# Altium project sha2017_rev1_0_0.PrjPcb
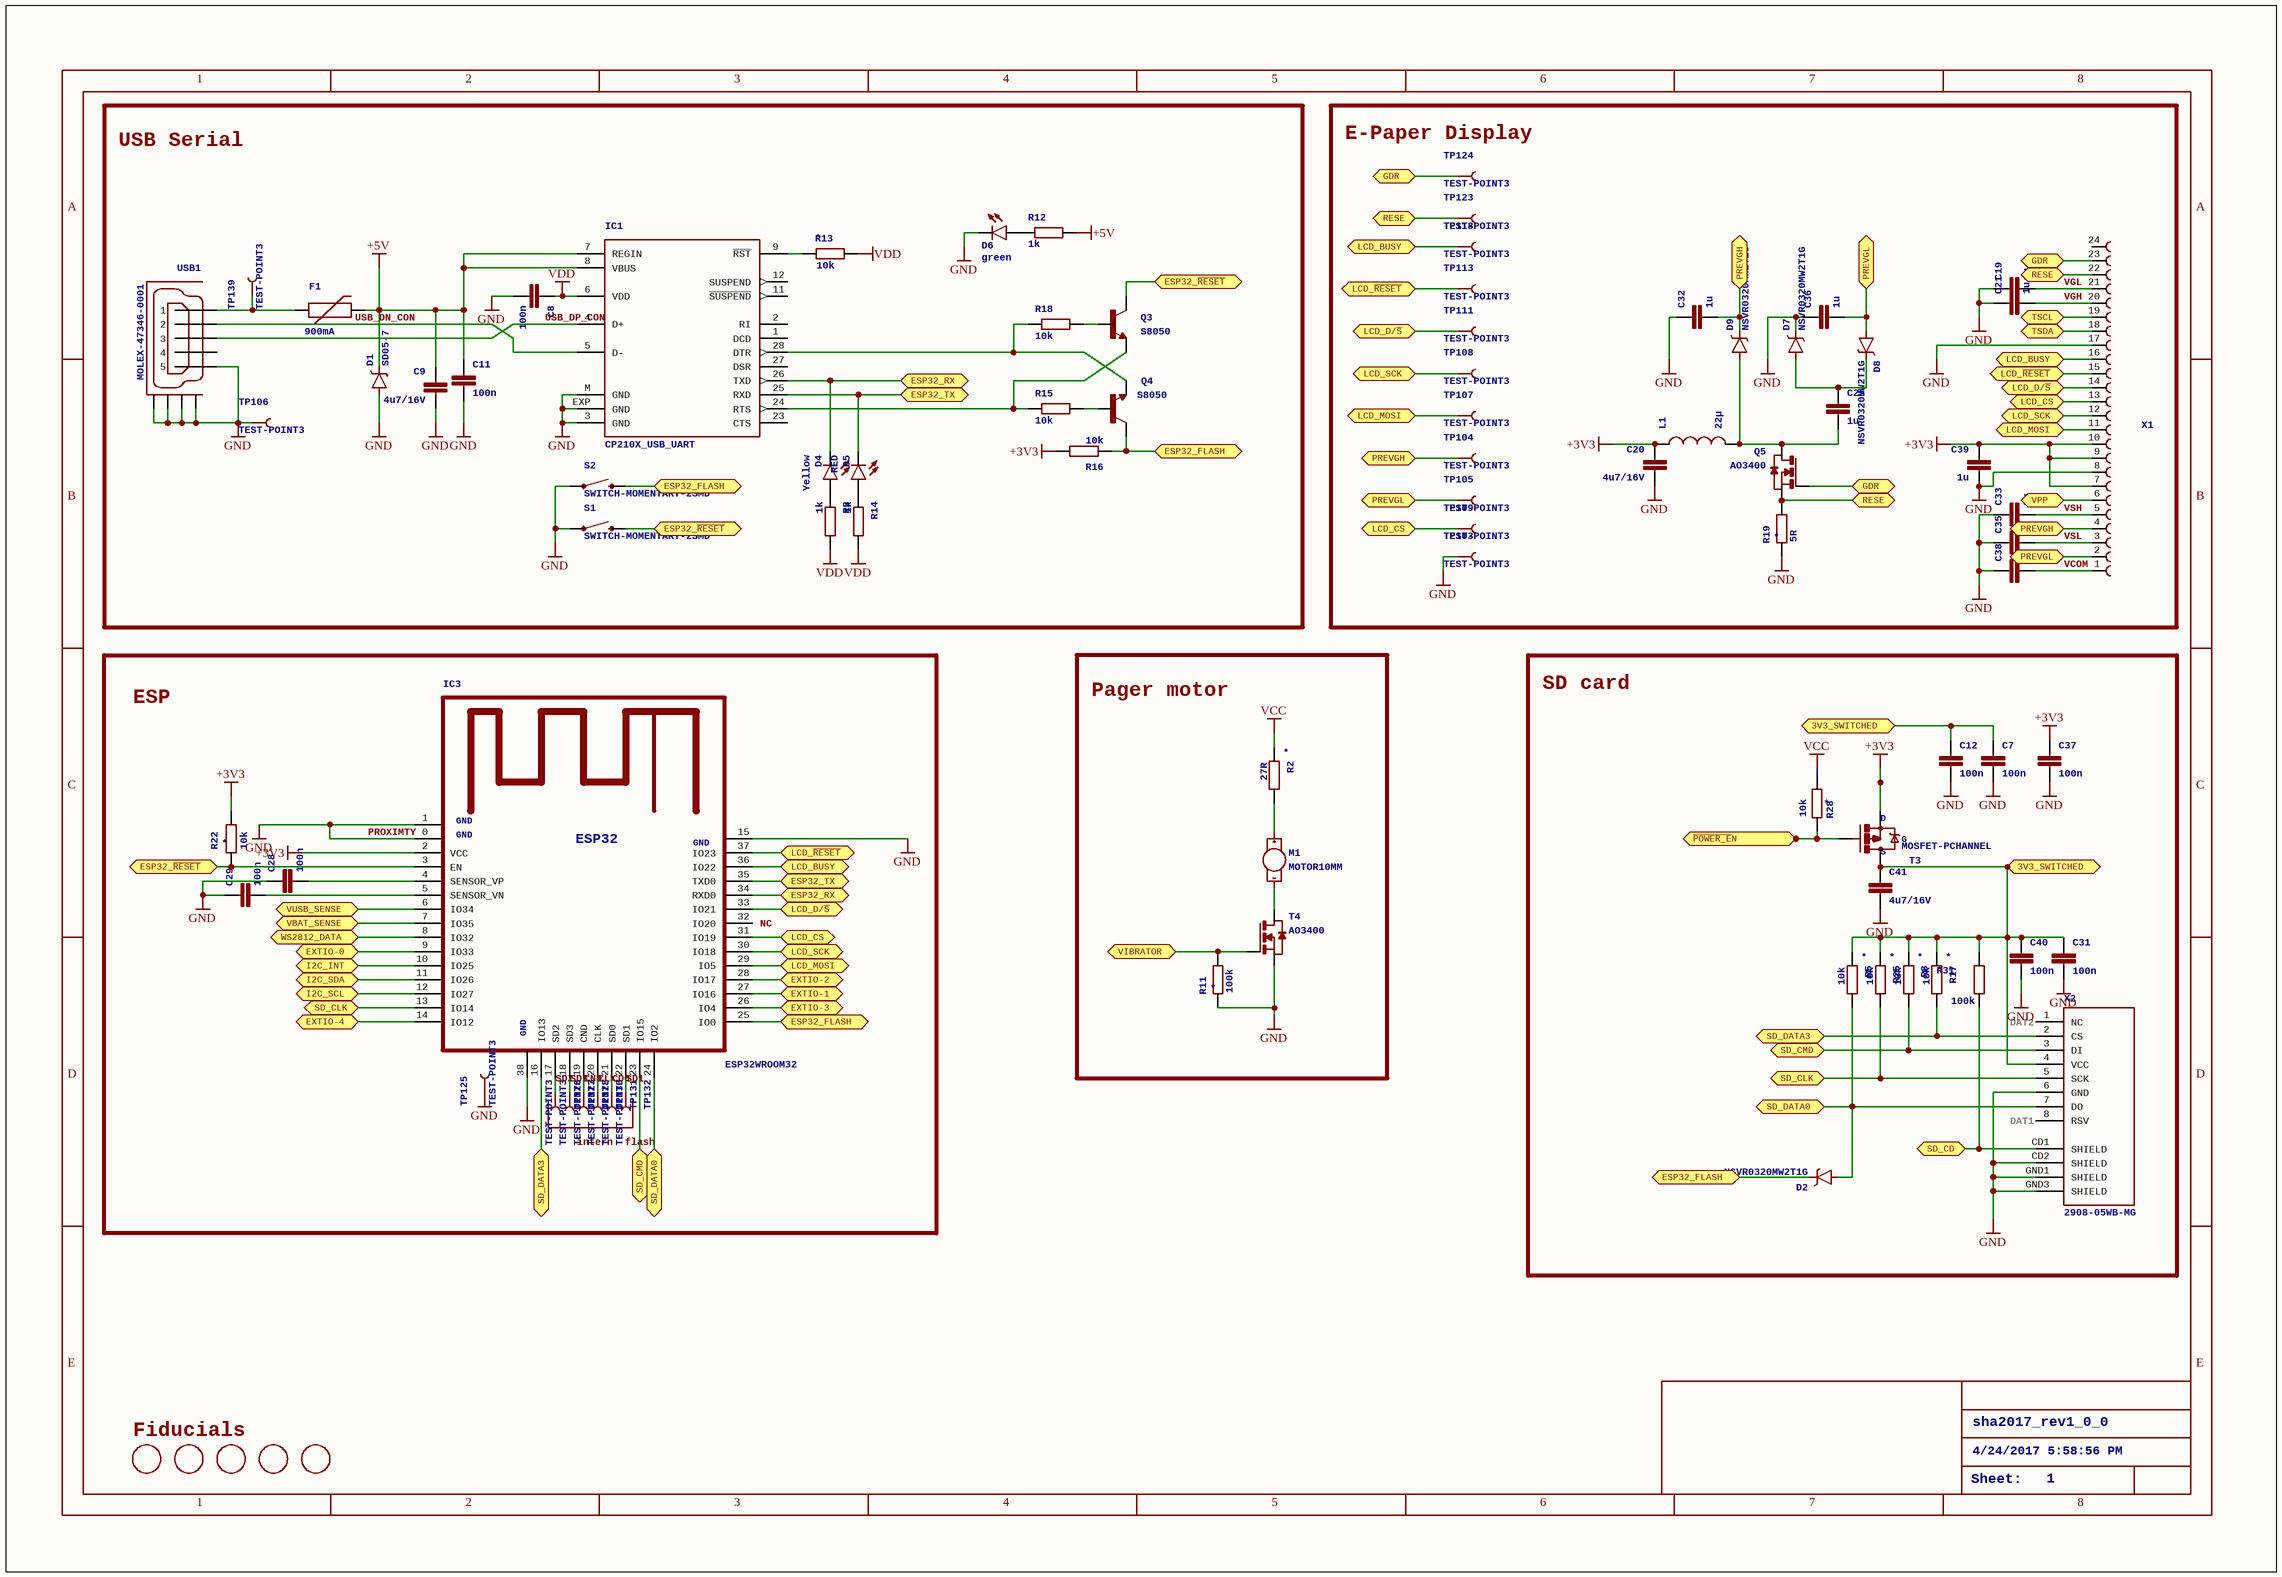
[diagram p0: sha2017_rev1_0_0_0.SchDoc]
3 sheets, 191 parts. Net scope: flat (ports and power ports of the same name join across sheets).
Board file: sha2017_rev1_0_0.PcbDoc
Sheets:
  sha2017_rev1_0_0_0.SchDoc
  sha2017_rev1_0_0_1.SchDoc
  sha2017_rev1_0_0_2.SchDoc

## Sheet sha2017_rev1_0_0_0.SchDoc: sha2017_rev1_0_0
size 409 x 282 mm; Date: 4/24/2017 5:58:56 PM; SheetNumber: 1

### Parts
C7  100n  [C0603-DASHES]
C8  100n  [C0603-DASHES]
C9  4u7/16V  [C0805]
C11  100n  [C0603-DASHES]
C12  100n  [C0603-DASHES]
C19  1u  [C0603-DASHES]
C20  4u7/16V  [C0805]
C21  1u  [C0603-DASHES]
C25  1u  [C0603-DASHES]
C28  100n  [C0603-DASHES]
C29  100n  [C0603-DASHES]
C31  100n  [C0603-DASHES]
C32  1u  [C0603-DASHES]
C33  1u  [C0603-DASHES]
C35  1u  [C0603-DASHES]
C36  1u  [C0603-DASHES]
C37  100n  [C0603-DASHES]
C38  1u  [C0603-DASHES]
C39  1u  [C0603-DASHES]
C40  100n  [C0603-DASHES]
C41  4u7/16V  [C0805]
D1  SD05-7  [SOD-323]
D2  NSVR0320MW2T1G  [SOD-323]
D4  Yellow  [LED-0603]
D5  RED  [LED-0603]
D6  green  [LED-0603]
D7  NSVR0320MW2T1G  [SOD-323]
D8  NSVR0320MW2T1G  [SOD-323]
D9  NSVR0320MW2T1G  [SOD-323]
F1  900mA  [PTC-1206]
FD1  FIDUCIAL  [FIDUCIAL_1MM]  (value not drawn)
FD2  FIDUCIAL  [FIDUCIAL_1MM]  (value not drawn)
FD3  FIDUCIAL  [FIDUCIAL_1MM]  (value not drawn)
FD4  FIDUCIAL  [FIDUCIAL_1MM]  (value not drawn)
FD5  FIDUCIAL  [FIDUCIAL_1MM]  (value not drawn)
IC1  CP210X_USB_UART  [MLP28]
IC3  ESP32WROOM32  [ESP32MOD]
L1  22µ  [1210]
M1  MOTOR10MM  [VIBE-MOTOR-10MM]
Q3  S8050  [SOT23-3]
Q4  S8050  [SOT23-3]
Q5  AO3400  [SOT-23]
R2  27R  [R0603-DASHES]
R3  1k  [R0603-DASHES]
R5  10k  [R0603-DASHES]
R8  10k  [R0603-DASHES]
R11  100k  [R0603-DASHES]
R12  1k  [R0603-DASHES]
R13  10k  [R0603-DASHES]
R14  1k  [R0603-DASHES]
R15  10k  [R0603-DASHES]
R16  10k  [R0603-DASHES]
R17  10k  [R0603-DASHES]
R18  10k  [R0603-DASHES]
R19  5R  [R0603-DASHES]
R22  10k  [R0603-DASHES]
R25  10k  [R0603-DASHES]
R28  10k  [R0603-DASHES]
R31  100k  [R0603-DASHES]
S1  SWITCH-MOMENTARY-2SMD  [TACTILE-SWITCH-SMD]
S2  SWITCH-MOMENTARY-2SMD  [TACTILE-SWITCH-SMD]
T3  MOSFET-PCHANNEL  [SOT23-3]
T4  AO3400  [SOT-23]
TP103  TEST-POINT3  [PAD.03X.03]
TP104  TEST-POINT3  [PAD.03X.03]
TP105  TEST-POINT3  [PAD.03X.03]
TP106  TEST-POINT3  [PAD.03X.03]
TP107  TEST-POINT3  [PAD.03X.03]
TP108  TEST-POINT3  [PAD.03X.03]
TP109  TEST-POINT3  [PAD.03X.03]
TP111  TEST-POINT3  [PAD.03X.03]
TP113  TEST-POINT3  [PAD.03X.03]
TP118  TEST-POINT3  [PAD.03X.03]
TP123  TEST-POINT3  [PAD.03X.03]
TP124  TEST-POINT3  [PAD.03X.03]
TP125  TEST-POINT3  [PAD.03X.03]
TP126  TEST-POINT3  [PAD.03X.03]
TP127  TEST-POINT3  [PAD.03X.03]
TP128  TEST-POINT3  [PAD.03X.03]
TP130  TEST-POINT3  [PAD.03X.03]
TP131  TEST-POINT3  [PAD.03X.03]
TP132  TEST-POINT3  [PAD.03X.03]
TP139  TEST-POINT3  [PAD.03X.03]
USB1  MOLEX-47346-0001  [MOLEX-47364-0001]
X1  68712414022  [68712414022]  (value not drawn)
X2  2908-05WB-MG  [MICRO-SD-SOCKET-PP]

### Blocks framed on the sheet
USB Serial: C8 C9 C11 D1 D4-D6 F1 IC1 Q3 Q4 R3 R12-R16 R18 S1 S2 TP106 TP139 USB1
E-Paper Display: C19-C21 C25 C32 C33 C35 C36 C38 C39 D7-D9 L1 Q5 R19 TP103-TP105 TP107-TP109 TP111 TP113 TP118 TP123 TP124 X1
ESP: C28 C29 IC3 R22 TP125-TP128 TP130-TP132
Pager motor: M1 R2 R11 T4
SD card: C7 C12 C31 C37 C40 C41 D2 R5 R8 R17 R25 R28 R31 T3 X2

### Ports
3V3_SWITCHED, ESP32_FLASH, ESP32_RX, ESP32_TX, ESP32_~{RESET}, EXTIO-0, EXTIO-1, EXTIO-2, EXTIO-3, EXTIO-4, GDR, I2C_INT, I2C_SCL, I2C_SDA, LCD_BUSY, LCD_CS, LCD_D/~{S}, LCD_MOSI, LCD_SCK, LCD_~{RESET}, PREVGH, PREVGL, RESE, SD_CD, SD_CLK, SD_CMD, SD_DATA0, SD_DATA3, TSCL, TSDA, VBAT_SENSE, VIBRATOR, VPP, VUSB_SENSE, WS2812_DATA, ~{POWER_E}N

### Nets
+3V3: C20.1 C37.1 C39.1 IC3.2(VCC) L1.1 R16.2 R22.1 T3.2(S) X1.7 X1.9 X1.10
+5V: C9.1 C11.1 D1.C F1.2 IC1.7(REGIN) IC1.8(VBUS) R12.2
PROXIMTY: C7.2 C8.2 C9.2 C11.2 C12.2 C19.1 C20.2 C21.1 C28.1 C29.1 C31.2 C32.1 C33.1 C35.1 C36.1 C37.2 C38.1 C39.2 C40.2 C41.2 D1.A D6.C D7.C IC1.3(GND) IC1.EXP(GND) IC1.M(GND) IC3.0(GND) IC3.1(GND) IC3.15(GND) IC3.38(GND) R11.2 R19.2 S1.1 S2.1 T4.2(S) TP103.P$1 TP106.P$1 TP125.P$1 USB1.5 USB1.GND1 USB1.GND2 USB1.GND3 USB1.GND4 X1.8 X1.17 X2.6(GND) X2.CD2(SHIELD) X2.GND1(SHIELD) X2.GND3(SHIELD)  [also labelled GND]
VCC: R2.2 R28.2
VDD: C8.1 IC1.6(VDD) R3.2 R13.1 R14.2
CD0: IC3.21(SD0) TP131.P$1
CLK: IC3.20(CLK) TP130.P$1
CND: IC3.19(CND) TP128.P$1
SD1: IC3.22(SD1) TP132.P$1
SD2: IC3.17(SD2) TP126.P$1
SD3: IC3.18(SD3) TP127.P$1
USB_DN_CON: IC1.5(D-) USB1.2
USB_DP_CON: IC1.4(D+) USB1.3
VCOM: C38.2 X1.1
VGH: C21.2 X1.20
VGL: C19.2 X1.21
VSH: C33.2 X1.5
VSL: C35.2 X1.3
NetC7_1: C7.1 C12.1 C31.1 C40.1 C41.1 R5.2 R8.2 R17.2 R25.2 R31.1 T3.3(D) X2.4(VCC) ; port 3V3_SWITCHED
NetC10_1: IC3.6(IO34) ; port VUSB_SENSE
NetC16_1: IC3.7(IO35) ; port VBAT_SENSE
NetC25_1: C25.1 D7.A D8.C
NetC25_2: C25.2 D9.A L1.2 Q5.1(D)
NetC28_2: C28.2 IC3.4(SENSOR_VP)
NetC29_2: C29.2 IC3.5(SENSOR_VN)
NetC32_2: C32.2 D9.C TP104.P$1 X1.4 ; port PREVGH
NetC36_2: C36.2 D8.A TP105.P$1 X1.2 ; port PREVGL
NetD2_A: D2.A IC3.24(IO2) R5.1 X2.7(DO) ; port SD_DATA0
NetD2_C: D2.C IC3.25(IO0) Q4.3(C) R16.1 S2.3 ; port ESP32_FLASH
NetD4_A: D4.A R3.1
NetD4_C: D4.C IC1.26(TXD) IC3.34(RXD0) ; port ESP32_RX
NetD5_A: D5.A R14.1
NetD5_C: D5.C IC1.25(RXD) IC3.35(TXD0) ; port ESP32_TX
NetD6_A: D6.A R12.1
NetD105_4: IC3.8(IO32) ; port WS2812_DATA
NetF1_1: F1.1 TP139.P$1 USB1.1
NetIC1_9: IC1.9(~{RST}) R13.2
NetIC1_24: IC1.24(RTS) Q3.2(E) R15.1
NetIC1_28: IC1.28(DTR) Q4.2(E) R18.1
NetIC3_3: IC3.3(EN) Q3.3(C) R22.2 S1.3 ; port ESP32_~{RESET}
NetIC3_9: IC3.9(IO33) ; port EXTIO-0
NetIC3_10: IC3.10(IO25) ; port I2C_INT
NetIC3_11: IC3.11(IO26) ; port I2C_SDA
NetIC3_12: IC3.12(IO27) ; port I2C_SCL
NetIC3_13: IC3.13(IO14) R25.1 X2.5(SCK) ; port SD_CLK
NetIC3_14: IC3.14(IO12) ; port EXTIO-4
NetIC3_16: IC3.16(IO13) R17.1 X2.2(CS) ; port SD_DATA3
NetIC3_23: IC3.23(IO15) R8.1 X2.3(DI) ; port SD_CMD
NetIC3_26: IC3.26(IO4) ; port EXTIO-3
NetIC3_27: IC3.27(IO16) ; port EXTIO-1
NetIC3_28: IC3.28(IO17) ; port EXTIO-2
NetIC3_29: IC3.29(IO5) TP107.P$1 X1.11 ; port LCD_MOSI
NetIC3_30: IC3.30(IO18) TP108.P$1 X1.12 ; port LCD_SCK
NetIC3_31: IC3.31(IO19) TP109.P$1 X1.13 ; port LCD_CS
NetIC3_33: IC3.33(IO21) TP111.P$1 X1.14 ; port LCD_D/~{S}
NetIC3_36: IC3.36(IO22) TP118.P$1 X1.16 ; port LCD_BUSY
NetIC3_37: IC3.37(IO23) TP113.P$1 X1.15 ; port LCD_~{RESET}
NetM1_+: M1.+ R2.1
NetM1_-: M1.- T4.1(D)
NetQ3_1: Q3.1(B) R18.2
NetQ4_1: Q4.1(B) R15.2
NetQ5_2: Q5.2(S) R19.1 TP123.P$1 X1.22 ; port RESE
NetQ5_3: Q5.3(G) TP124.P$1 X1.23 ; port GDR
NetR11_1: R11.1 T4.3(G) ; port VIBRATOR
NetR28_1: R28.1 T3.1(G) ; port ~{POWER_E}N
NetR31_2: R31.2 X2.CD1(SHIELD) ; port SD_CD
NetX1_6: X1.6 ; port VPP
NetX1_18: X1.18 ; port TSDA
NetX1_19: X1.19 ; port TSCL

Not connected (* = marked no-connect by the designer): IC1 1(DCD) 2(RI) 11(~{SUSPEND}) 12(SUSPEND) 23(CTS) 27(DSR); IC3 32(IO20); USB1 4; X1 24; X2 1(NC) 8(RSV)

### Notes on the sheet
- (near IC3) NC
- DAT2
- intern
  flash
- (near X2) DAT1
- Fiducials
- sha2017_rev1_0_0
- 4/24/2017 5:58:56 PM
- Sheet:
- 1
- 2
- 3
- 4
- 5
- 6
- 7
- 8
- A
- B
- C
- D
- E

### Library data of the parts
C7 C8 C11 C12 C19 C21 C25 C28 C29 C31-C33 C35-C40 = C0603-DASHES: PARTNO: *
  C28 C29: MF: *; MPN: *; OC_FARNELL: *
C9 C20 C41 = C-EUC0805: CAPACITOR, European symbol; PARTNO: *
D1 = DIODE-SCHOTTKY-PMEG4005EJ: Schottky diodes in SFE's production catalog   BAT20J 1A 23V 0.62Vf RB751 120mA 40V 0.37Vf PMEG4005EJ 0.5A 40V 0.42Vf MBRA140 1A 40V 0.5Vf B340A  3A 40V SMA; PROD_ID: DIO-10955; PARTNO: *
D2 D7-D9 = BAT20JFILM: 23V, 1A Schottky diode, SOD-323 package; PROD_ID: DIO-11623; PARTNO: *
D4-D6 = LED0603: LEDsStandard schematic elements and footprints for 5mm, 3mm, 1206, and 0603 sized LEDs. 5mm - Spark Fun Electronics SKU : COM-00529 (and others)
F1 = PTCSMD: Resettable Fuse PTCResettable Fuse. Spark Fun Electronics SKU : COM-08357; PROD_ID: RES-11150; PARTNO: *
FD1-FD5 = FIDUCIAL: For use by pick and place machines to calibrate the vision/machine, 1mm    By microbuilder.eu; MF: *; MPN: *; OC_FARNELL: *; PARTNO: *
IC1 = CP210X_USB_UART: Single-Chip USB to UART Bridge   Source: www.silabs.com .. CP2101.pdf / cp2102.pdf. Spark Fun Electronics SKU : COM-00310; PARTNO: *
L1 = INDUCTOR1210: Inductors   Basic Inductor/Choke - 0603 and 1206. Footprints are not proven and vary greatly between part numbers. SRN6045- 33uH, 20% 1.4A SDR0403-560KL - 56uH, 10%, 500mA RMS/740mA peak; PARTNO: *
M1 = MOTOR10MM: Vibration Motor- ROB-08449Physical dimension and wire connections for this powerful vibration motor. Motor has a self adhesive backing.
Q3 Q4 = TRANSISTOR_NPNMMBT2222A: Generic NPN BJT   MMBT2222A - TRANS-08049 (SOT-23, 1A 40V) MPSA42 - TRANS-09116 (SOT-23, 500mA 300V) MMBT5088LT1G - TRANS-11160 (SOT-23, 50 mA 30V)          BC547 -     COM-08928    (TO-92 45V 100mA) (1.Collector 2.Base 3.Emitter)             2N3904 -     COM-00521    (TO-92 40V 200mA) (1.Emitter 2.Base 3.Collector)             P2N2222A -     COM-12852    (TO-92 40V 600mA) (1.Collector 2.Base 3.Emitter); PARTNO: *; PROD_ID: TRANS-08049
Q5 T4 = NMOSSOT23: MOS FET; MF: *; MPN: *; OC_FARNELL: unknown; OC_NEWARK: unknown
R2 R3 R5 R8 R11-R19 R22 R25 R28 R31 = R0603-DASHES: PARTNO: *
  R2 R5 R8 R11 R13 R17 R19 R25 R28 R31: NAME: *
  R22: MF: *; MPN: *; NAME: *; OC_FARNELL: *
S1 S2 = SWITCH-MOMENTARY-2SMD: Various NO switches- pushbuttons, reed, etc; PROD_ID: SWCH-08247; PARTNO: *
T3 = MOSFET-PCHANNEL: Generic PMOSFET    IRLML2244 - TRANS-11153 (SOT-23 -20V -4.3A) (1.Gate 2.Source 3.Drain)     FQP27P06 - COM-10349(TO-220 -60V -27A) (1.Gate 2.Source 3.Drain); PROD_ID: TRANS-08285; PARTNO: *; D: D; S: S; G: G
TP103-TP109 TP111 TP113 TP118 TP123-TP128 TP130-TP132 TP139 = TEST-POINT3: Bare copper test points for troubleshooting or ICT; PARTNO: *
USB1 = MOLEX-47346-0001: MICRO USB B, BOTTOM MOUNT; PARTNO: *
X1 = 68712414022: WR-FPC 0.5mm SMT ZIF Horizontal Top Contact, 24 Pins=>Code : Con_FPC_ZIF_0.50_68712414022     Details see: http://katalog.we-online.de/en/em/687_1xx_140_22   Created 2014-07-09, Karrer Zheng 2014 (C) WÃ¼rth Elektronik; PARTNO: *
X2 = 2908-05WB-MG: 3M Card Connector microSD   Normal Polarisation, Push-Push, Surface-Mount, 2900 Series    2908-05WB-MG: Surface mount, right angle Supplier: DigiKey 3M5607CT-ND       Source: http://solutions.3m.com/wps/portal/3M/en_US/FP/FireProtection/Products/ProductCatalog/?PC_7_RJH9U5230GE3E02LECFTDQ0R92_nid=GGFDLLB87CbeGKZPW31NMHgl; PARTNO: *
IC3 = ESP32WROOM32: ESP32: ESP32; GND: GND

## Sheet sha2017_rev1_0_0_1.SchDoc: sha2017_rev1_0_0
size 409 x 282 mm; Date: 4/24/2017 5:58:59 PM; SheetNumber: 2
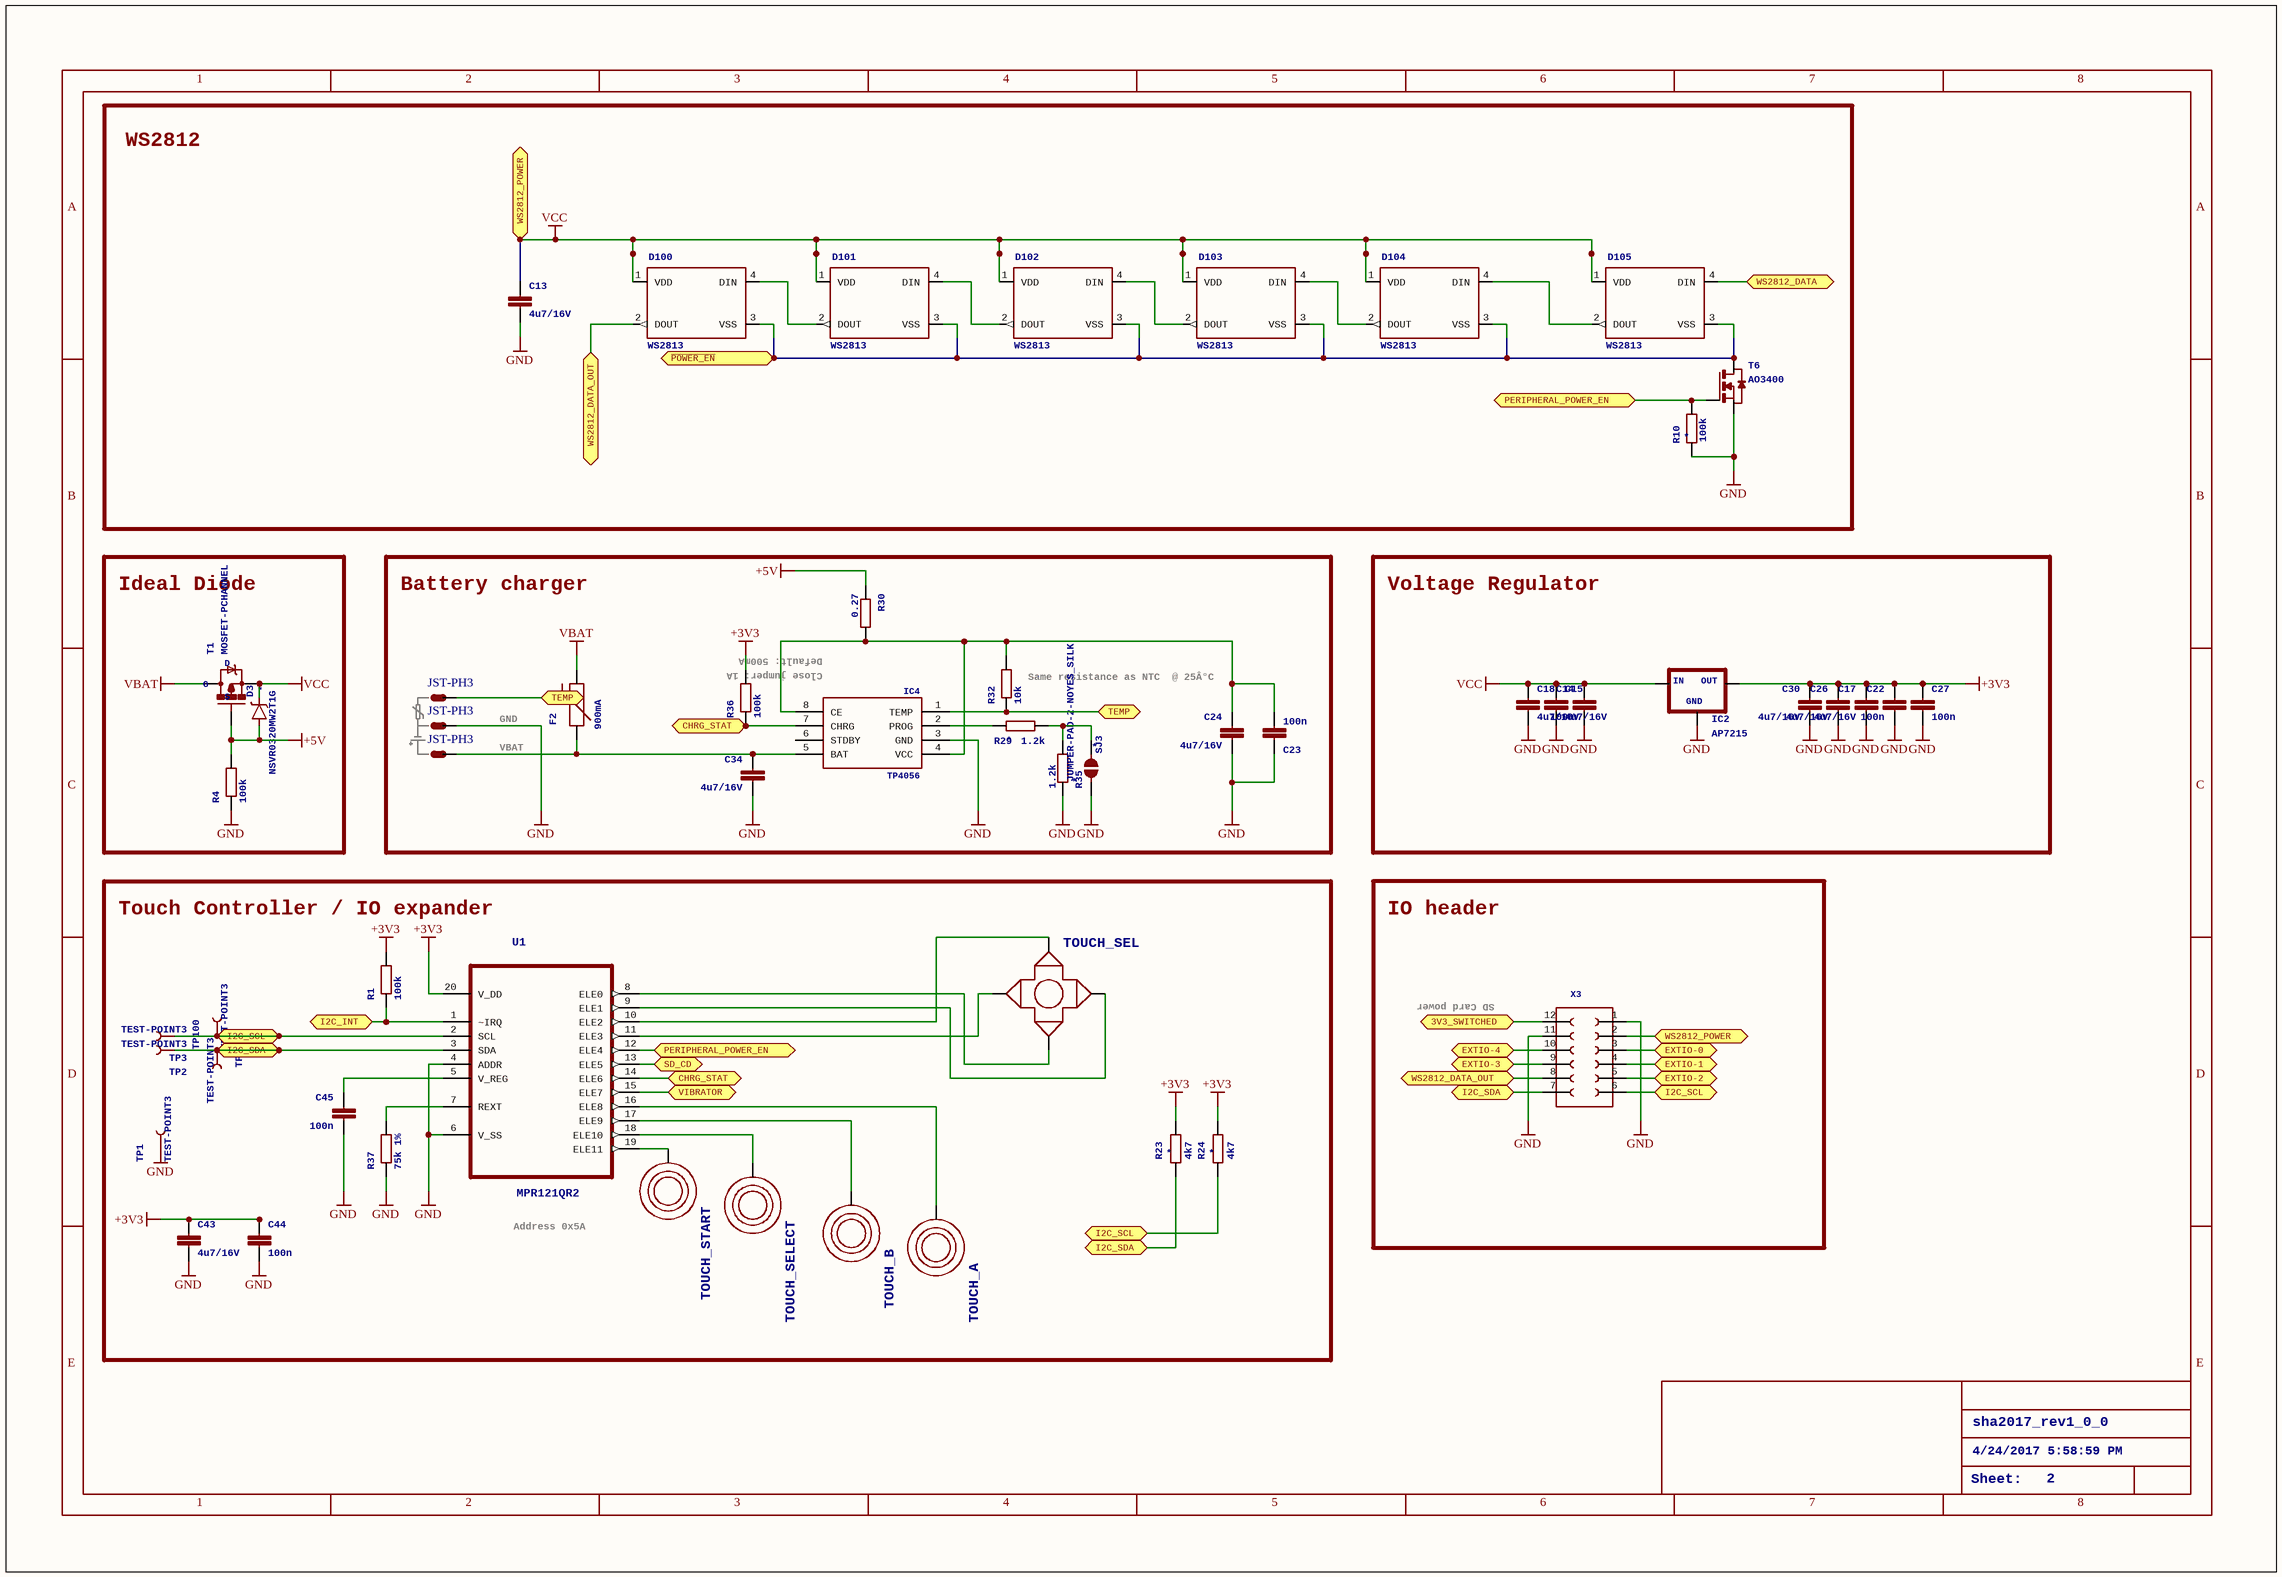
[diagram p1: sha2017_rev1_0_0_1.SchDoc]

### Parts
C13  4u7/16V  [C0805]
C14  100n  [C0603-DASHES]
C15  4u7/16V  [C0805]
C17  4u7/16V  [C0805]
C18  4u7/16V  [C0805]
C22  100n  [C0603-DASHES]
C23  100n  [C0603-DASHES]
C24  4u7/16V  [C0805]
C26  4u7/16V  [C0805]
C27  100n  [C0603-DASHES]
C30  4u7/16V  [C0805]
C34  4u7/16V  [C0805]
C43  4u7/16V  [C0805]
C44  100n  [C0603-DASHES]
C45  100n  [C0603-DASHES]
D3  NSVR0320MW2T1G  [SOD-323]
D100  WS2813  [WS2812B]
D101  WS2813  [WS2812B]
D102  WS2813  [WS2812B]
D103  WS2813  [WS2812B]
D104  WS2813  [WS2812B]
D105  WS2813  [WS2812B]
F2  900mA  [PTC-1206]
IC2  AP7215  [SOT89]
IC4  TP4056  [SOP-8]
R1  100k  [R0603-DASHES]
R4  100k  [R0603-DASHES]
R10  100k  [R0603-DASHES]
R23  4k7  [R0603-DASHES]
R24  4k7  [R0603-DASHES]
R29  1.2k  [R0603-DASHES]
R30  0.27  [R0603-DASHES]
R32  10k  [R0603-DASHES]
R35  1.2k  [R0603-DASHES]
R36  100k  [R0603-DASHES]
R37  75k 1%  [R0603-DASHES]
SJ3  JUMPER-PAD-2-NOYES_SILK  [PAD-JUMPER-2-NO_YES_SILK]
T1  MOSFET-PCHANNEL  [SOT23-3]
T6  AO3400  [SOT-23]
TOUCH_A  TOUCHROUND  [TOUCH_BUTTON]  (value not drawn)
TOUCH_B  TOUCHROUND  [TOUCH_BUTTON]  (value not drawn)
TOUCH_SEL  TOUCH_CROSS  [TOUCH_CROSS]  (value not drawn)
TOUCH_SELECT  TOUCHSELECT  [TOUCH_SELECT]  (value not drawn)
TOUCH_START  TOUCHSELECT  [TOUCH_SELECT]  (value not drawn)
TP1  TEST-POINT3  [PAD.03X.03]
TP2  TEST-POINT3  [PAD.03X.03]
TP3  TEST-POINT3  [PAD.03X.03]
TP100  TEST-POINT3  [PAD.03X.03]
TP101  TEST-POINT3  [PAD.03X.03]
U1  MPR121QR2  [QFN40P300X300X60-20N]
X3  610X12243021  [610X12243021]  (value not drawn)
X4  JST-PH3  [JST-PH3]  (parts A,B,C of 3)

### Blocks framed on the sheet
WS2812: C13 D100-D105 R10 T6
Ideal Diode: D3 R4 T1
Battery charger: C23 C24 C34 F2 IC4 R29 R30 R32 R35 R36 SJ3 X4
Voltage Regulator: C14 C15 C17 C18 C22 C26 C27 C30 IC2
Touch Controller / IO expander: C43-C45 R1 R23 R24 R37 TOUCH_A TOUCH_B TOUCH_SEL TOUCH_SELECT TOUCH_START TP1-TP3 TP100 TP101 U1
IO header: X3

### Ports
3V3_SWITCHED, CHRG_STAT, EXTIO-0, EXTIO-1, EXTIO-2, EXTIO-3, EXTIO-4, I2C_INT, I2C_SCL, I2C_SDA, PERIPHERAL_POWER_EN, SD_CD, TEMP, VIBRATOR, WS2812_DATA, WS2812_DATA_OUT, WS2812_POWER, ~{POWER_EN}

### Nets
+3V3: C17.1 C22.1 C26.1 C27.1 C30.1 C43.1 C44.1 IC2.3(OUT) R1.2 R23.1 R24.1 R36.2 U1.20(V_DD)
+5V: D3.A R4.2 R30.1 T1.1(G)
GND: C13.2 C14.2 C15.2 C17.2 C18.2 C22.2 C23.1 C24.2 C26.2 C27.2 C30.2 C34.2 C43.2 C44.2 C45.2 IC2.1(GND) IC4.3(GND) R4.1 R10.2 R35.2 R37.1 SJ3.1 T6.2(S) TP1.P$1 U1.4(ADDR) U1.6(V_SS) X3.1 X3.11 X4.2  [project net PROXIMTY]
VBAT: F2.2 T1.3(D)
VCC: C13.1 C14.1 C15.1 C18.1 D3.C D100.1(VDD) D101.1(VDD) D102.1(VDD) D103.1(VDD) D104.1(VDD) D105.1(VDD) IC2.2_2@(IN) T1.2(S) X3.2 ; port WS2812_POWER
NetC7_1: X3.12 ; port 3V3_SWITCHED
NetC23_2: C23.2 C24.1 IC4.4(VCC) IC4.8(CE) R30.2 R32.2
NetC34_1: C34.1 F2.1 IC4.5(BAT) X4.3
NetC45_1: C45.1 U1.5(V_REG)
NetD100_2: D100.2(DOUT) X3.8 ; port WS2812_DATA_OUT
NetD100_3: D100.3(VSS) D101.3(VSS) D102.3(VSS) D103.3(VSS) D104.3(VSS) D105.3(VSS) T6.1(D) ; port ~{POWER_EN}
NetD100_4: D100.4(DIN) D101.2(DOUT)
NetD101_4: D101.4(DIN) D102.2(DOUT)
NetD102_4: D102.4(DIN) D103.2(DOUT)
NetD103_4: D103.4(DIN) D104.2(DOUT)
NetD104_4: D104.4(DIN) D105.2(DOUT)
NetD105_4: D105.4(DIN) ; port WS2812_DATA
NetIC3_9: X3.3 ; port EXTIO-0
NetIC3_10: R1.1 U1.1(~IRQ) ; port I2C_INT
NetIC3_11: R23.2 TP2.P$1 TP101.P$1 U1.3(SDA) X3.7 ; port I2C_SDA
NetIC3_12: R24.2 TP3.P$1 TP100.P$1 U1.2(SCL) X3.6 ; port I2C_SCL
NetIC3_14: X3.10 ; port EXTIO-4
NetIC3_26: X3.9 ; port EXTIO-3
NetIC3_27: X3.4 ; port EXTIO-1
NetIC3_28: X3.5 ; port EXTIO-2
NetIC4_1: IC4.1(TEMP) R32.1 X4.1 ; port TEMP
NetIC4_2: IC4.2(PROG) R29.1
NetIC4_7: IC4.7(CHRG) R36.1 U1.14(ELE6) ; port CHRG_STAT
NetR10_1: R10.1 T6.3(G) U1.12(ELE4) ; port PERIPHERAL_POWER_EN
NetR11_1: U1.15(ELE7) ; port VIBRATOR
NetR29_2: R29.2 R35.1 SJ3.2
NetR31_2: U1.13(ELE5) ; port SD_CD
NetR37_2: R37.2 U1.7(REXT)
NetTOUCH_A_P$1: TOUCH_A.P$1 U1.16(ELE8)
NetTOUCH_B_P$1: TOUCH_B.P$1 U1.17(ELE9)
NetTOUCH_SEL_D: TOUCH_SEL.D(DOWN) U1.8(ELE0)
NetTOUCH_SEL_L: TOUCH_SEL.L(LEFT) U1.11(ELE3)
NetTOUCH_SEL_R: TOUCH_SEL.R(RIGHT) U1.9(ELE1)
NetTOUCH_SEL_UP: TOUCH_SEL.UP U1.10(ELE2)
NetTOUCH_SELECT_P$1: TOUCH_SELECT.P$1 U1.18(ELE10)
NetTOUCH_START_P$1: TOUCH_START.P$1 U1.19(ELE11)

Not connected (* = marked no-connect by the designer): IC4 6(STDBY)

### Notes on the sheet
- Default: 500mA
- Close jumper: 1A
- (near R32) Same resistance as NTC
  @ 25Â°C
- GND
- VBAT
- SD Card power
- Address 0x5A
- sha2017_rev1_0_0
- 4/24/2017 5:58:59 PM
- Sheet:
- 2
- 1
- 3
- 4
- 5
- 6
- 7
- 8
- A
- B
- C
- D
- E

### Library data of the parts
C13 C15 C17 C18 C24 C26 C30 C34 C43 = C-EUC0805: CAPACITOR, European symbol; PARTNO: *
C14 C22 C23 C27 C44 C45 = C0603-DASHES: PARTNO: *
D3 = BAT20JFILM: as D2 on sheet sha2017_rev1_0_0_0; NAME: *; PARTNO: *
D100-D105 = WS2812B: WS2812B - Intelligent control LED integrated light source    Technical Specifications:  Power Supply Voltage (VDD): 3.5 to 5.3 V  Input Voltage (VI): -0.5 to VDD+0.5 V  Operating Junction Temperature (Topt): -25Â°C to +80Â°C  Storage Temperature Range (Tstg): -55Â°C to +150Â°C; PARTNO: *
F2 = PTCSMD: as F1 on sheet sha2017_rev1_0_0_0; PARTNO: *
R1 R4 R10 R23 R24 R29 R30 R32 R35-R37 = R0603-DASHES: PARTNO: *
  R10 R29 R35: NAME: *
  R23 R24: MF: *; MPN: *; NAME: *; OC_FARNELL: *
T1 = MOSFET-PCHANNEL: as T3 on sheet sha2017_rev1_0_0_0; PARTNO: *; D: D; S: S; G: G
T6 = NMOSSOT23: MOS FET; MF: *; MPN: *; OC_FARNELL: unknown; OC_NEWARK: unknown
TP1-TP3 TP100 TP101 = TEST-POINT3: as TP103 on sheet sha2017_rev1_0_0_0; PARTNO: *
U1 = MPR121QR2: Proximity Capacitive Touch Sensor Controller; MPN: MPR121QR2; OC_FARNELL: 1858714; OC_NEWARK: 24R9786; PACKAGE: QFN-20; SUPPLIER: Freescale
X3 = 610X12243021: WR-PHD 2.54mm SMT Dual Socket Header Bottom Entry, 12 Pins=>Code : Con_BTB_SHD_2.54_2_610x12243021(packageing:x = 0: Tube x = 3: Tape & Reel with Cap)     Details see: 6100xx243021 http://katalog.we-online.de/en/em/PHD_2_54_SMT_DUAL_SOCKET_HEADER_BOTTOM_ENTRY_6100XX243021   6103xx243021 http://katalog.we-online.de/en/em/PHD_2_54_SMT_DUAL_SOCKET_HEADER_BOTTOM_ENTRY_6103XX243021   2014 (C) WÃ¼rth Elektronik; PARTNO: *
IC2 = AP7215: PARTNO: *; GND: GND; IN: IN; OUT: OUT
SJ3 = JUMPER-PAD-2-NOYES_SILK: NAME: *; PARTNO: *
TOUCH_A TOUCH_B = TOUCHROUND: PARTNO: *
TOUCH_SEL = TOUCH_CROSS: PARTNO: *

## Sheet sha2017_rev1_0_0_2.SchDoc: sha2017_rev1_0_0
size 409 x 282 mm; Date: 4/24/2017 5:59:01 PM; SheetNumber: 3
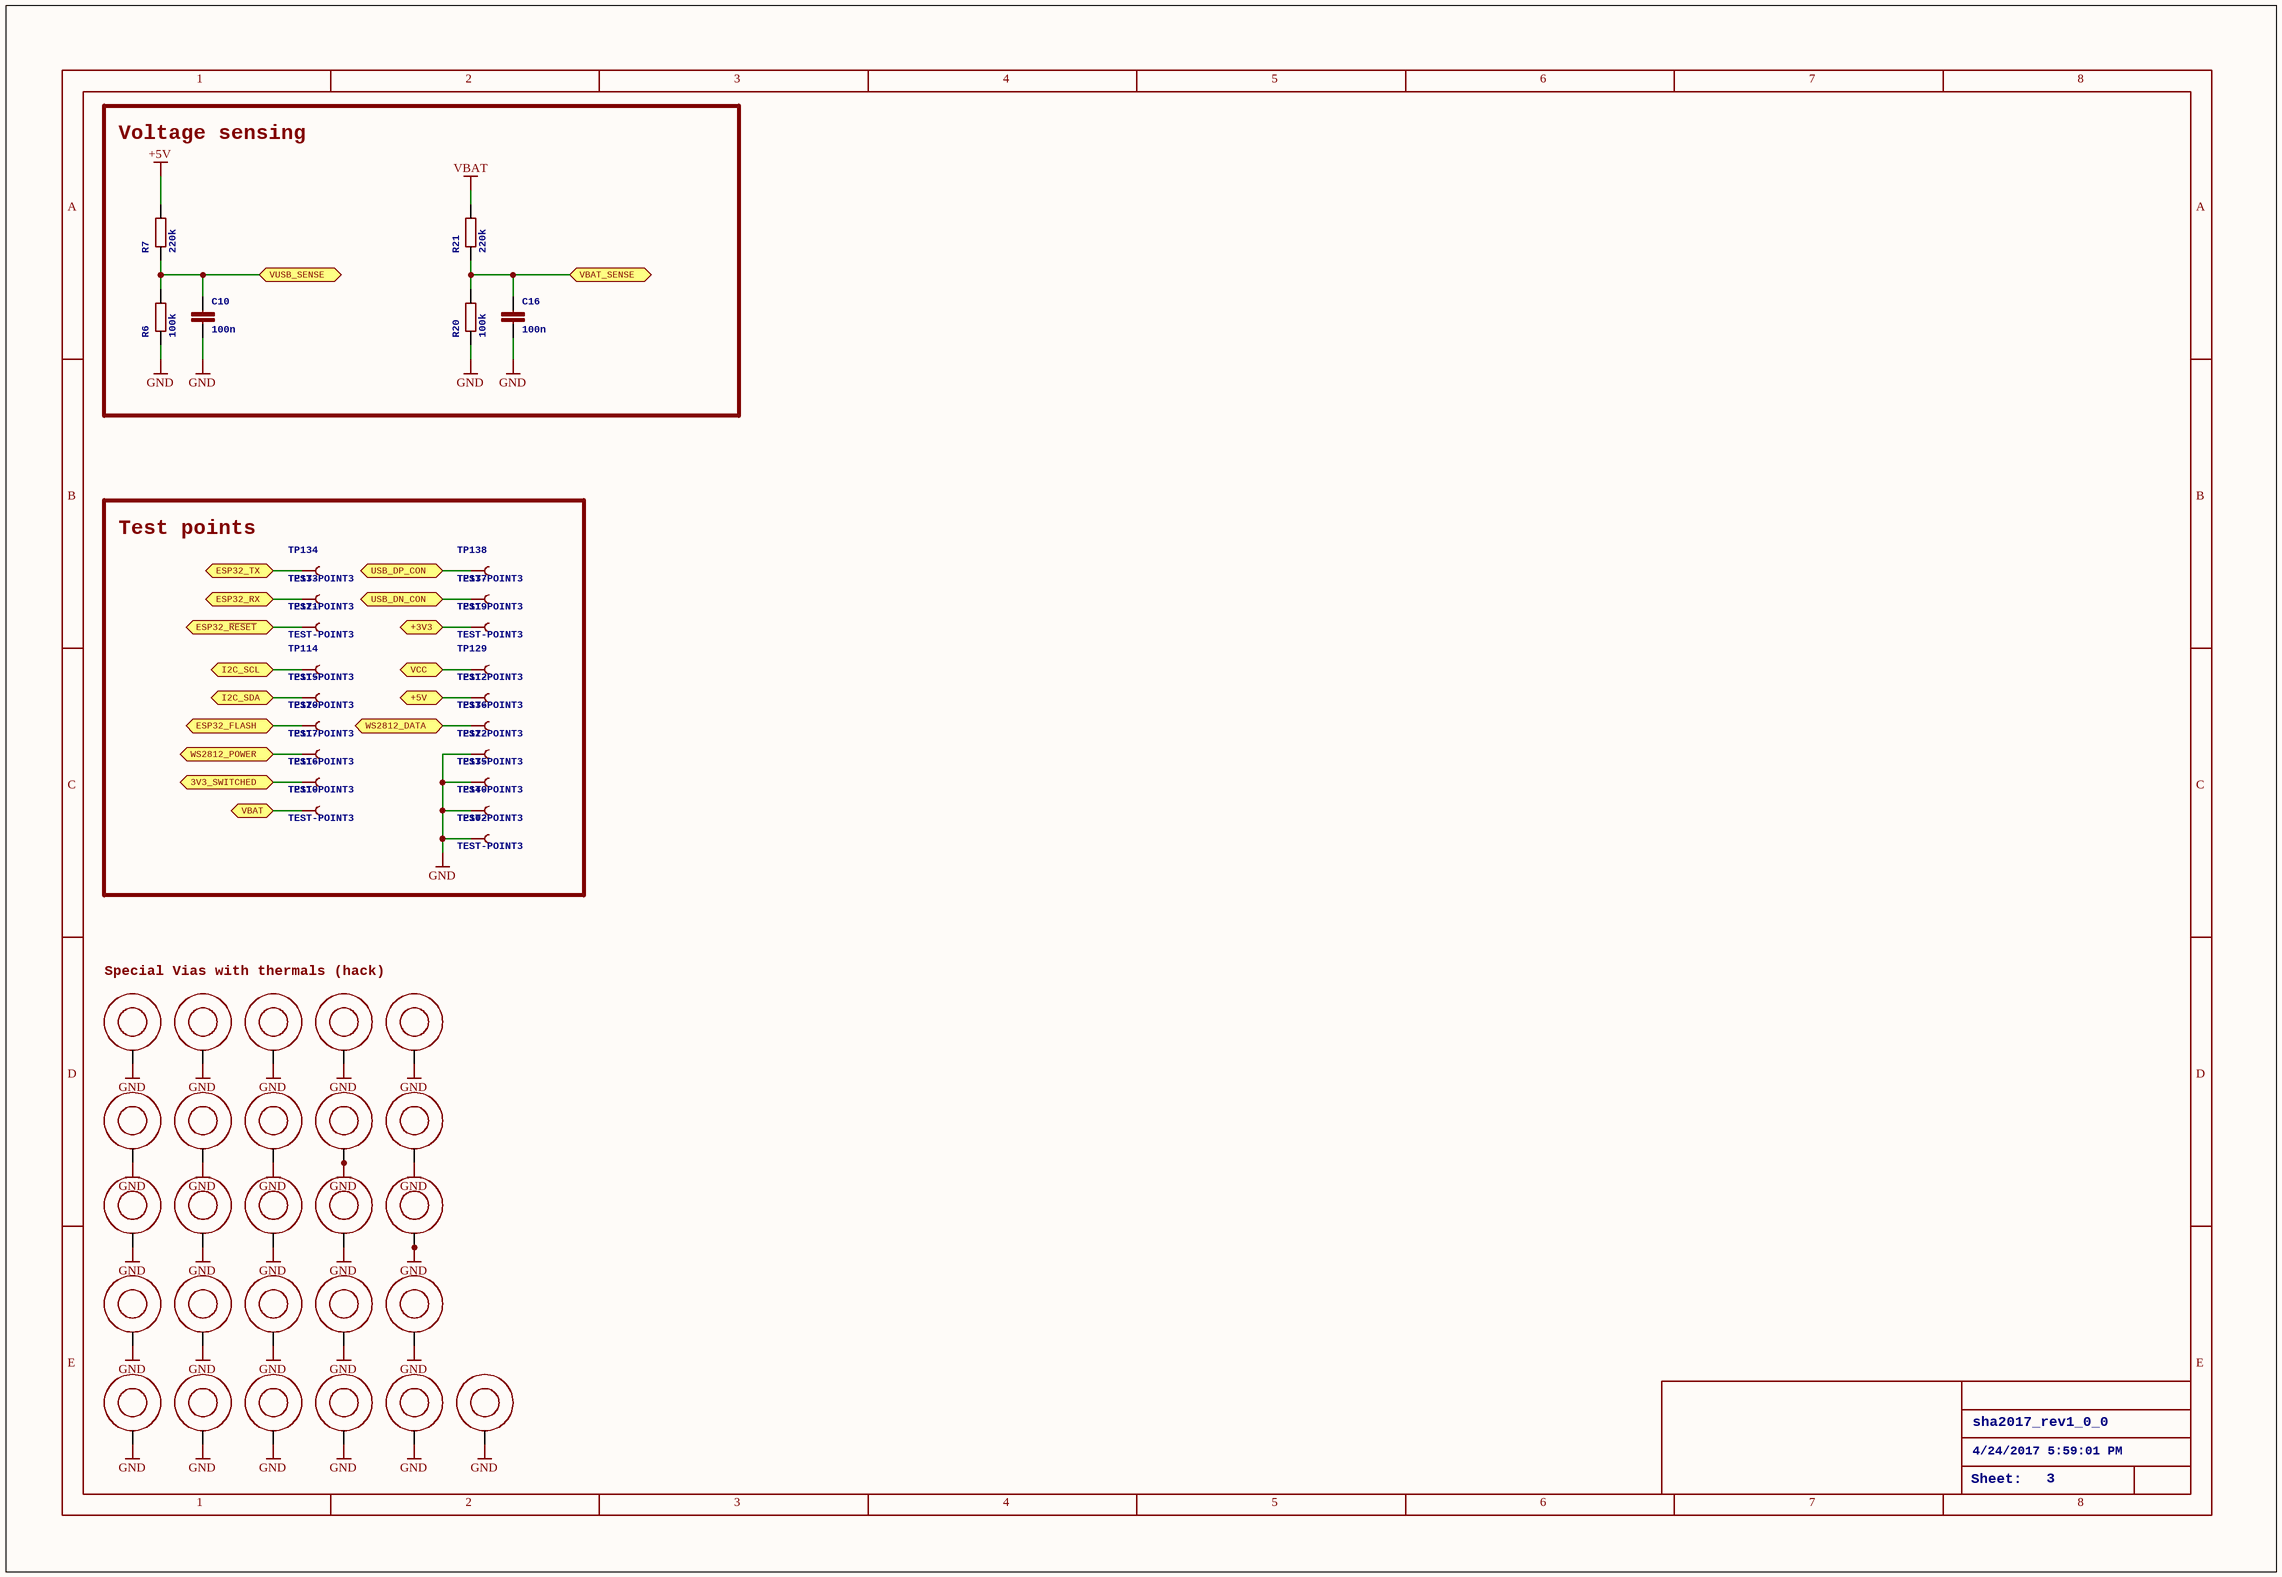
[diagram p2: sha2017_rev1_0_0_2.SchDoc]

### Parts
$$U$1  VIA  [VIA]  (value not drawn)
$$U$2  VIA  [VIA]  (value not drawn)
$$U$3  VIA  [VIA]  (value not drawn)
$$U$4  VIA  [VIA]  (value not drawn)
$$U$5  VIA  [VIA]  (value not drawn)
$$U$6  VIA  [VIA]  (value not drawn)
$$U$7  VIA  [VIA]  (value not drawn)
$$U$8  VIA  [VIA]  (value not drawn)
$$U$9  VIA  [VIA]  (value not drawn)
C10  100n  [C0603-DASHES]
C16  100n  [C0603-DASHES]
R6  100k  [R0603-DASHES]
R7  220k  [R0603-DASHES]
R20  100k  [R0603-DASHES]
R21  220k  [R0603-DASHES]
TP102  TEST-POINT3  [PAD.03X.03]
TP110  TEST-POINT3  [PAD.03X.03]
TP112  TEST-POINT3  [PAD.03X.03]
TP114  TEST-POINT3  [PAD.03X.03]
TP115  TEST-POINT3  [PAD.03X.03]
TP116  TEST-POINT3  [PAD.03X.03]
TP117  TEST-POINT3  [PAD.03X.03]
TP119  TEST-POINT3  [PAD.03X.03]
TP120  TEST-POINT3  [PAD.03X.03]
TP121  TEST-POINT3  [PAD.03X.03]
TP122  TEST-POINT3  [PAD.03X.03]
TP129  TEST-POINT3  [PAD.03X.03]
TP133  TEST-POINT3  [PAD.03X.03]
TP134  TEST-POINT3  [PAD.03X.03]
TP135  TEST-POINT3  [PAD.03X.03]
TP136  TEST-POINT3  [PAD.03X.03]
TP137  TEST-POINT3  [PAD.03X.03]
TP138  TEST-POINT3  [PAD.03X.03]
TP140  TEST-POINT3  [PAD.03X.03]
U$2  VIA  [VIA]  (value not drawn)
U$3  VIA  [VIA]  (value not drawn)
U$4  VIA  [VIA]  (value not drawn)
U$5  VIA  [VIA]  (value not drawn)
U$6  VIA  [VIA]  (value not drawn)
U$10  VIA  [VIA]  (value not drawn)
U$11  VIA  [VIA]  (value not drawn)
U$12  VIA  [VIA]  (value not drawn)
U$13  VIA  [VIA]  (value not drawn)
U$14  VIA  [VIA]  (value not drawn)
U$15  VIA  [VIA]  (value not drawn)
U$16  VIA  [VIA]  (value not drawn)
U$17  VIA  [VIA]  (value not drawn)
U$18  VIA  [VIA]  (value not drawn)
U$19  VIA  [VIA]  (value not drawn)
U$20  VIA  [VIA]  (value not drawn)
U$21  VIA  [VIA]  (value not drawn)
U$22  VIA  [VIA]  (value not drawn)
U$23  VIA  [VIA]  (value not drawn)

### Blocks framed on the sheet
Voltage sensing: C10 C16 R6 R7 R20 R21
Test points: TP102 TP110 TP112 TP114-TP117 TP119-TP122 TP129 TP133-TP138 TP140

### Ports
3V3_SWITCHED, +3V3, +5V, ESP32_FLASH, ESP32_RX, ESP32_TX, ESP32_~{RESET}, I2C_SCL, I2C_SDA, USB_DN_CON, USB_DP_CON, VBAT, VBAT_SENSE, VCC, VUSB_SENSE, WS2812_DATA, WS2812_POWER

### Nets
+5V: R7.2
GND: $$U$1.P$1 $$U$2.P$1 $$U$3.P$1 $$U$4.P$1 $$U$5.P$1 $$U$6.P$1 $$U$7.P$1 $$U$8.P$1 $$U$9.P$1 C10.2 C16.2 R6.1 R20.1 TP102.P$1 TP122.P$1 TP135.P$1 TP140.P$1 U$2.P$1 U$3.P$1 U$4.P$1 U$5.P$1 U$6.P$1 U$10.P$1 U$11.P$1 U$12.P$1 U$13.P$1 U$14.P$1 U$15.P$1 U$16.P$1 U$17.P$1 U$18.P$1 U$19.P$1 U$20.P$1 U$21.P$1 U$22.P$1 U$23.P$1  [project net PROXIMTY]
VBAT: R21.2
VCC: TP117.P$1 ; port WS2812_POWER
NetC7_1: TP116.P$1 ; port 3V3_SWITCHED
NetC10_1: C10.1 R6.2 R7.1 ; port VUSB_SENSE
NetC16_1: C16.1 R20.2 R21.1 ; port VBAT_SENSE
NetD2_C: TP120.P$1 ; port ESP32_FLASH
NetD4_C: TP133.P$1 ; port ESP32_RX
NetD5_C: TP134.P$1 ; port ESP32_TX
NetD105_4: TP136.P$1 ; port WS2812_DATA
NetIC3_3: TP121.P$1 ; port ESP32_~{RESET}
NetIC3_11: TP115.P$1 ; port I2C_SDA
NetIC3_12: TP114.P$1 ; port I2C_SCL
NetTP110_P$1: TP110.P$1 ; port VBAT
NetTP112_P$1: TP112.P$1 ; port +5V
NetTP119_P$1: TP119.P$1 ; port +3V3
NetTP129_P$1: TP129.P$1 ; port VCC
NetTP137_P$1: TP137.P$1 ; port USB_DN_CON
NetTP138_P$1: TP138.P$1 ; port USB_DP_CON

### Notes on the sheet
- Special Vias with thermals (hack)
- sha2017_rev1_0_0
- 4/24/2017 5:59:01 PM
- Sheet:
- 3
- 1
- 2
- 4
- 5
- 6
- 7
- 8
- A
- B
- C
- D
- E

### Library data of the parts
C10 C16 = C0603-DASHES: MF: *; MPN: *; OC_FARNELL: *; PARTNO: *
R6 R7 R20 R21 = R0603-DASHES: PARTNO: *
TP102 TP110 TP112 TP114-TP117 TP119-TP122 TP129 TP133-TP138 TP140 = TEST-POINT3: as TP103 on sheet sha2017_rev1_0_0_0; PARTNO: *
$$U$1-$$U$9 U$2-U$6 U$10-U$23 = VIA: PARTNO: *

## Nets that join several sheets
+3V3: sha2017_rev1_0_0_0 (11 pins), sha2017_rev1_0_0_1 (13 pins)
+5V: sha2017_rev1_0_0_0 (7 pins), sha2017_rev1_0_0_1 (D3.A R4.2 R30.1 T1.1), sha2017_rev1_0_0_2 (R7.2)
PROXIMTY: sha2017_rev1_0_0_0 (49 pins), sha2017_rev1_0_0_1 (29 pins), sha2017_rev1_0_0_2 (36 pins)
VBAT: sha2017_rev1_0_0_1 (F2.2 T1.3), sha2017_rev1_0_0_2 (R21.2)
VCC: sha2017_rev1_0_0_0 (R2.2 R28.2), sha2017_rev1_0_0_1 (14 pins), sha2017_rev1_0_0_2 (TP117.P$1)
NetC7_1: sha2017_rev1_0_0_0 (12 pins), sha2017_rev1_0_0_1 (X3.12), sha2017_rev1_0_0_2 (TP116.P$1)
NetC10_1: sha2017_rev1_0_0_0 (IC3.6), sha2017_rev1_0_0_2 (C10.1 R6.2 R7.1)
NetC16_1: sha2017_rev1_0_0_0 (IC3.7), sha2017_rev1_0_0_2 (C16.1 R20.2 R21.1)
NetD2_C: sha2017_rev1_0_0_0 (5 pins), sha2017_rev1_0_0_2 (TP120.P$1)
NetD4_C: sha2017_rev1_0_0_0 (D4.C IC1.26 IC3.34), sha2017_rev1_0_0_2 (TP133.P$1)
NetD5_C: sha2017_rev1_0_0_0 (D5.C IC1.25 IC3.35), sha2017_rev1_0_0_2 (TP134.P$1)
NetD105_4: sha2017_rev1_0_0_0 (IC3.8), sha2017_rev1_0_0_1 (D105.4), sha2017_rev1_0_0_2 (TP136.P$1)
NetIC3_3: sha2017_rev1_0_0_0 (IC3.3 Q3.3 R22.2 S1.3), sha2017_rev1_0_0_2 (TP121.P$1)
NetIC3_9: sha2017_rev1_0_0_0 (IC3.9), sha2017_rev1_0_0_1 (X3.3)
NetIC3_10: sha2017_rev1_0_0_0 (IC3.10), sha2017_rev1_0_0_1 (R1.1 U1.1)
NetIC3_11: sha2017_rev1_0_0_0 (IC3.11), sha2017_rev1_0_0_1 (5 pins), sha2017_rev1_0_0_2 (TP115.P$1)
NetIC3_12: sha2017_rev1_0_0_0 (IC3.12), sha2017_rev1_0_0_1 (5 pins), sha2017_rev1_0_0_2 (TP114.P$1)
NetIC3_14: sha2017_rev1_0_0_0 (IC3.14), sha2017_rev1_0_0_1 (X3.10)
NetIC3_26: sha2017_rev1_0_0_0 (IC3.26), sha2017_rev1_0_0_1 (X3.9)
NetIC3_27: sha2017_rev1_0_0_0 (IC3.27), sha2017_rev1_0_0_1 (X3.4)
NetIC3_28: sha2017_rev1_0_0_0 (IC3.28), sha2017_rev1_0_0_1 (X3.5)
NetR11_1: sha2017_rev1_0_0_0 (R11.1 T4.3), sha2017_rev1_0_0_1 (U1.15)
NetR31_2: sha2017_rev1_0_0_0 (R31.2 X2.CD1), sha2017_rev1_0_0_1 (U1.13)